# EAGLE design PCB_CanneASon (EAGLE 9.6.2)
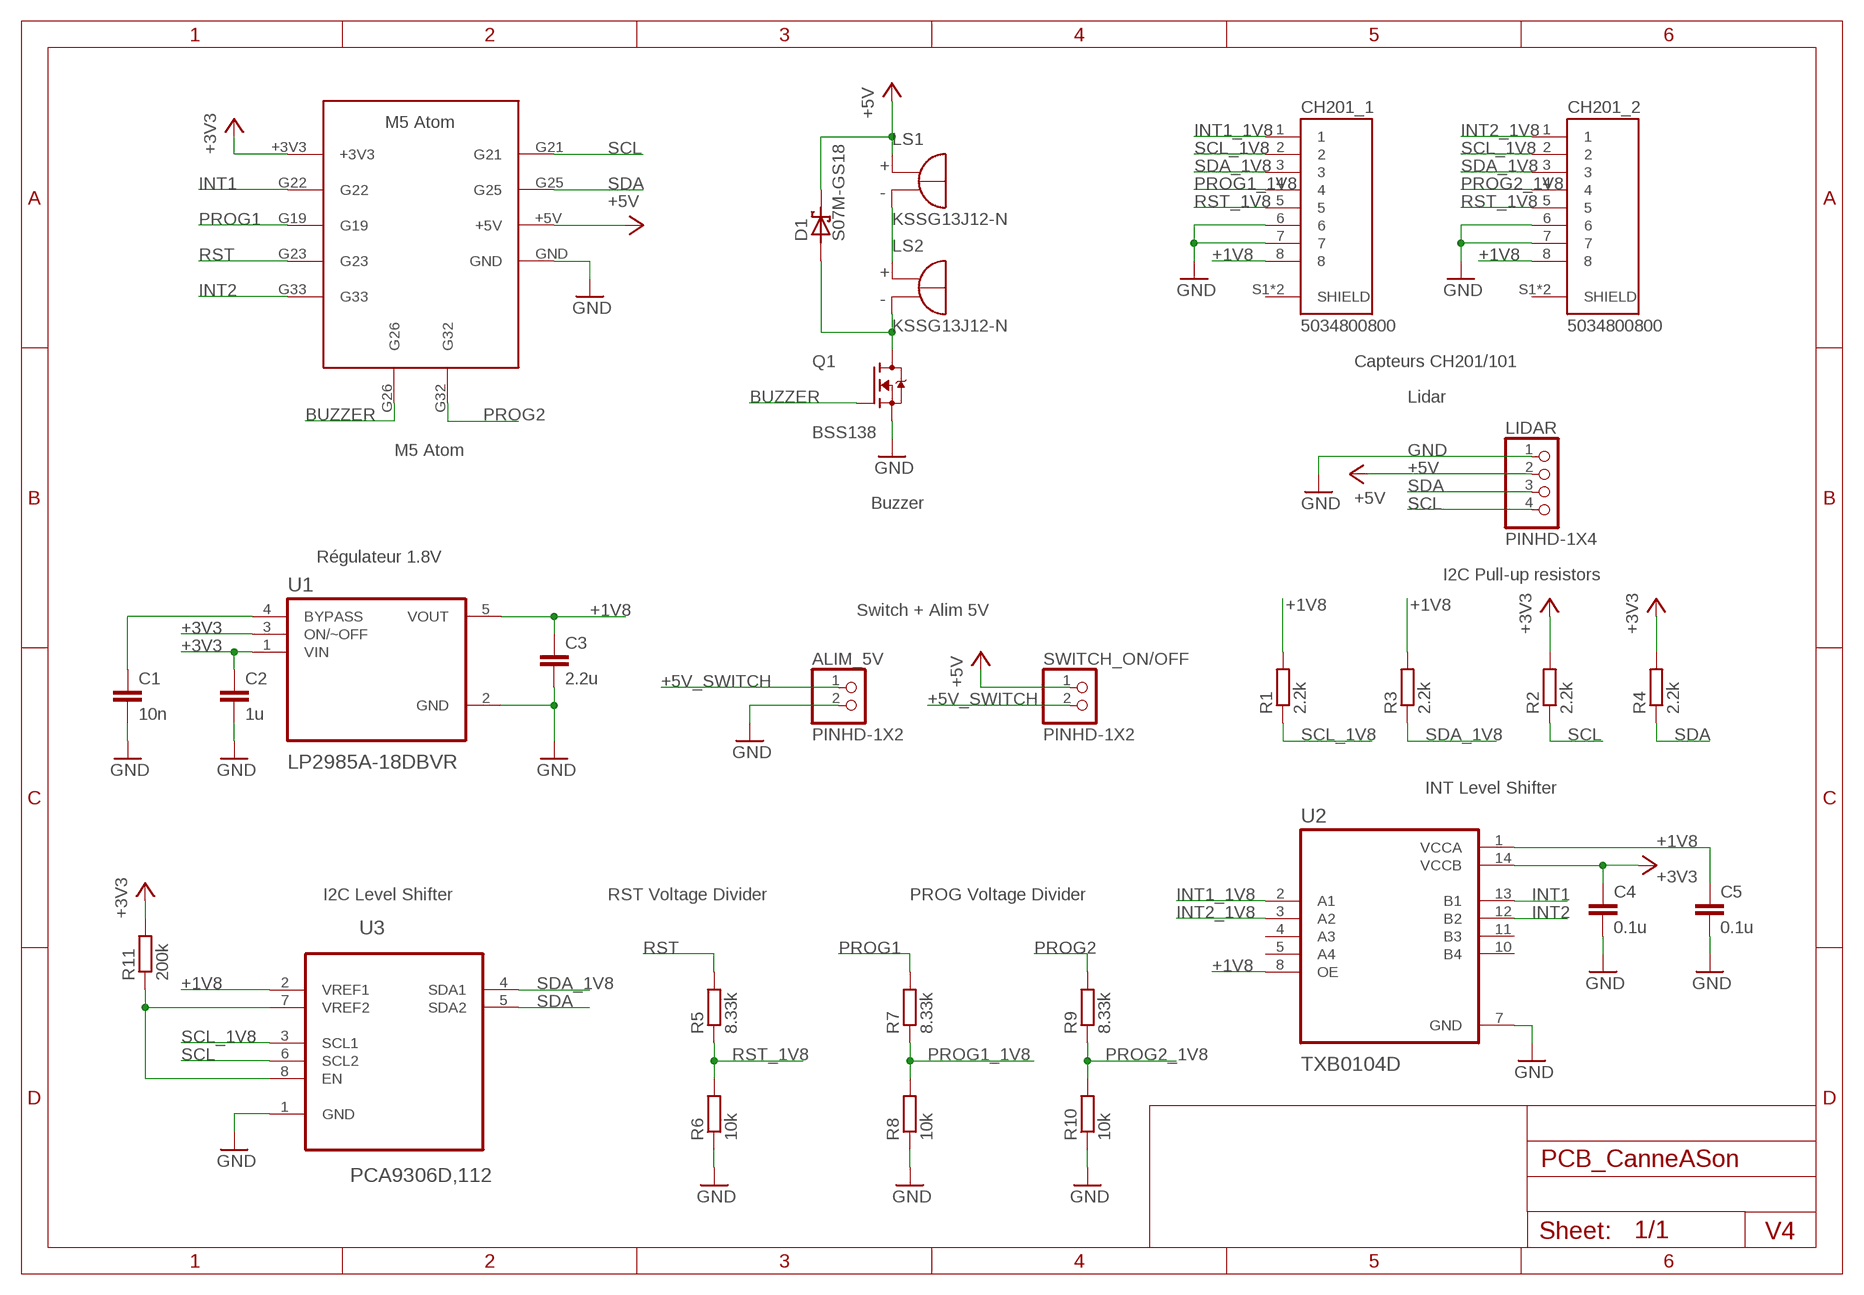
[diagram p0: schematic, sheet 1]

## Parts
ALIM_5V  PINHD-1X2  [1X02]
C1  10n  C-EUC0805  [C0805]
C2  1u  C-EUC0805  [C0805]
C3  2.2u  C-EUC0805  [C0805]
C4  0.1u  C-EUC0805  [C0805]
C5  0.1u  C-EUC0805  [C0805]
CH201_1  5034800800  [MOLEX_5034800800]
CH201_2  5034800800  [MOLEX_5034800800]
D1  S07M-GS18  [DO-219AB]
LIDAR  PINHD-1X4  [1X04]
LS1  KSSG13J12-N  [XDCR_KSSG13J12-N]
LS2  KSSG13J12-N  [XDCR_KSSG13J12-N]
Q1  BSS138  [SOT95P240X111-3N]
R1  2.2k  R-EU_R0805  [R0805]
R2  2.2k  R-EU_R0805  [R0805]
R3  2.2k  R-EU_R0805  [R0805]
R4  2.2k  R-EU_R0805  [R0805]
R5  8.33k  R-EU_R0805  [R0805]
R6  10k  R-EU_R0805  [R0805]
R7  8.33k  R-EU_R0805  [R0805]
R8  10k  R-EU_R0805  [R0805]
R9  8.33k  R-EU_R0805  [R0805]
R10  10k  R-EU_R0805  [R0805]
R11  200k  R-EU_R0805  [R0805]
SWITCH_ON/OFF  PINHD-1X2  [1X02]
U1  LP2985A-18DBVR  [SOT95P280X145-5N]
U2  TXB0104D  [SOIC127P600X175-14N]
U3  PCA9306D,112  [SOIC127P600X175-8N]
U$1  M5ATOM  [M5ATOM]

## Nets
+1V8: C3.1 C5.1 CH201_1.8 CH201_2.8 R1.2 R3.2 U1.5(VOUT) U2.1(VCCA) U2.8(OE) U3.2(VREF1)
+3V3: C2.1 C4.1 R2.2 R4.2 R11.2 U1.1(VIN) U1.3(ON/~OFF) U2.14(VCCB) U$1.+3V3
+5V: D1.C LIDAR.2 LS1.P(POS) SWITCH_ON/OFF.1 U$1.+5V
+5V_SWITCH: ALIM_5V.1 SWITCH_ON/OFF.2
BUZZER: Q1.1(G) U$1.G26
GND: ALIM_5V.2 C1.2 C2.2 C3.2 C4.2 C5.2 CH201_1.6 CH201_1.7 CH201_2.6 CH201_2.7 LIDAR.1 Q1.2(S) R6.1 R8.1 R10.1 U1.2(GND) U2.7(GND) U3.1(GND) U$1.GND
INT1: U2.13(B1) U$1.G22
INT1_1V8: CH201_1.1 U2.2(A1)
INT2: U2.12(B2) U$1.G33
INT2_1V8: CH201_2.1 U2.3(A2)
N$1: C1.1 U1.4(BYPASS)
N$2: LS1.N(NEG) LS2.P(POS)
N$3: D1.A LS2.N(NEG) Q1.3(D)
N$5: R11.1 U3.7(VREF2) U3.8(EN)
PROG1: R7.2 U$1.G19
PROG1_1V8: CH201_1.4 R7.1 R8.2
PROG2: R9.2 U$1.G32
PROG2_1V8: CH201_2.4 R9.1 R10.2
RST: R5.2 U$1.G23
RST_1V8: CH201_1.5 CH201_2.5 R5.1 R6.2
SCL: LIDAR.4 R2.1 U3.6(SCL2) U$1.G21
SCL_1V8: CH201_1.2 CH201_2.2 R1.1 U3.3(SCL1)
SDA: LIDAR.3 R4.1 U3.5(SDA2) U$1.G25
SDA_1V8: CH201_1.3 CH201_2.3 R3.1 U3.4(SDA1)
Unconnected: CH201_1.S1(SHIELD) CH201_1.S2(SHIELD) CH201_2.S1(SHIELD) CH201_2.S2(SHIELD) U2.4(A3) U2.5(A4) U2.10(B4) U2.11(B3)

## Notes on the sheet
- Capteurs CH201/101
- Lidar
- M5 Atom
- Buzzer
- Régulateur 1.8V
- I2C Pull-up resistors
- Switch + Alim 5V
- INT Level Shifter
- I2C Level Shifter | RST Voltage Divider | PROG Voltage Divider
- V4

## Library data of the parts
ALIM_5V SWITCH_ON/OFF = Connector:PINHD-1X2: PIN HEADER; CATEGORY: CONNECTOR; SUB-CATEGORY: PIN-HEADER
C1-C5 = rcl:C-EU: CAPACITOR, European symbol; SPICEPREFIX: C
CH201_1 CH201_2 = 5034800800:5034800800: 8 Position FFC, FPC Connector Contacts, Top and Bottom 0.020" (0.50mm) Surface Mount, Right Angle Check availability <https://pricing.snapeda.com/parts/5034800800/Molex/view-part?ref=eda>; AVAILABILITY: In Stock; DESCRIPTION: 8 Position FFC, FPC Connector Contacts, Top and Bottom 0.020 (0.50mm) Surface Mount, Right Angle; MF: Molex; MP: 5034800800; PACKAGE: None; PRICE: None; PURCHASE-URL: https://pricing.snapeda.com/search/part/5034800800/?ref=eda
D1 = S07M-GS18:S07M-GS18; AVAILABILITY: In Stock; DESCRIPTION: Diode Schottky 150 V 1A Surface Mount DO-219AB (SMF); MF: Vishay; MP: V1FM15HM3/I; PACKAGE: DO-219AB Vishay; PRICE: None; PURCHASE-URL: https://pricing.snapeda.com/search/part/V1FM15HM3/I/?ref=eda
LIDAR = Connector:PINHD-1X4: PIN HEADER; CATEGORY: CONNECTOR; SUB-CATEGORY: PIN-HEADER
LS1 LS2 = KSSG13J12-N:KSSG13J12-N: Check availability <https://pricing.snapeda.com/parts/KSSG13J12-N/Kingstate/view-part?ref=eda>; AVAILABILITY: In Stock; DESCRIPTION: 5mm, 2~4V,2.73KHz, 78dB, Magnetic Buzzer, SMT; MF: Kingstate; MP: KSSG13J12-N; PACKAGE: PLCC-28 Kingstate; PRICE: None
Q1 = BSS138:BSS138: N-Channel 50V 220mA (Ta) 360mW (Ta) Surface Mount SOT-23-3 Check availability <https://pricing.snapeda.com/parts/BSS138/ON%20Semiconductor/view-part?ref=eda>; AVAILABILITY: In Stock; DESCRIPTION: N-Channel 50 V 200mA (Ta) 225mW (Ta) Surface Mount SOT-23-3 (TO-236); MF: ON Semiconductor; MP: BSS138; PACKAGE: SOT-23 ON; PRICE: None; PURCHASE-URL: https://pricing.snapeda.com/search/part/BSS138/?ref=eda
R1-R11 = rcl:R-EU_: RESISTOR, European symbol; SPICEPREFIX: R
U1 = LP2985A-18DBVR:LP2985A-18DBVR; DESCRIPTION: 150-mA, 16-V, low-dropout voltage regulator with high-accuracy; DIGI-KEY_PART_NUMBER: 296-18477-2-ND; MF: Texas Instruments; MP: LP2985A-18DBVR; PACKAGE: SOT-23-5 Texas Instruments; PURCHASE-URL: https://pricing.snapeda.com/search/part/LP2985A-18DBVR/?ref=eda
U2 = TXB0104D:TXB0104D: Check availability <https://pricing.snapeda.com/parts/TXB0104D/Texas%20Instruments/view-part?ref=eda>; AVAILABILITY: In Stock; DESCRIPTION: 4-Bit Bidirectional Voltage-Level Shifter with Auto Direction Sensing and +/-15 kV ESD Protect; MF: Texas Instruments; MP: TXB0104D; PACKAGE: SOIC-14 Texas Instruments; PRICE: None; PURCHASE-URL: https://pricing.snapeda.com/search/part/TXB0104D/?ref=eda
U3 = PCA9306D_112:PCA9306D,112: Dual bidirectional I2C-bus and SMBus voltage-level translator Check availability <https://pricing.snapeda.com/parts/PCA9306D%2C112/NXP%20USA/view-part?ref=eda>; AVAILABILITY: In Stock; DESCRIPTION: Voltage Level Translator Bidirectional 1 Circuit 2 Channel - 8-SO; MF: NXP USA; MP: PCA9306D,112; PACKAGE: SO-8 NXP Semiconductors; PRICE: None; PURCHASE-URL: https://pricing.snapeda.com/search/part/PCA9306D,112/?ref=eda
U$1 = M5Atom:M5ATOM

## Board
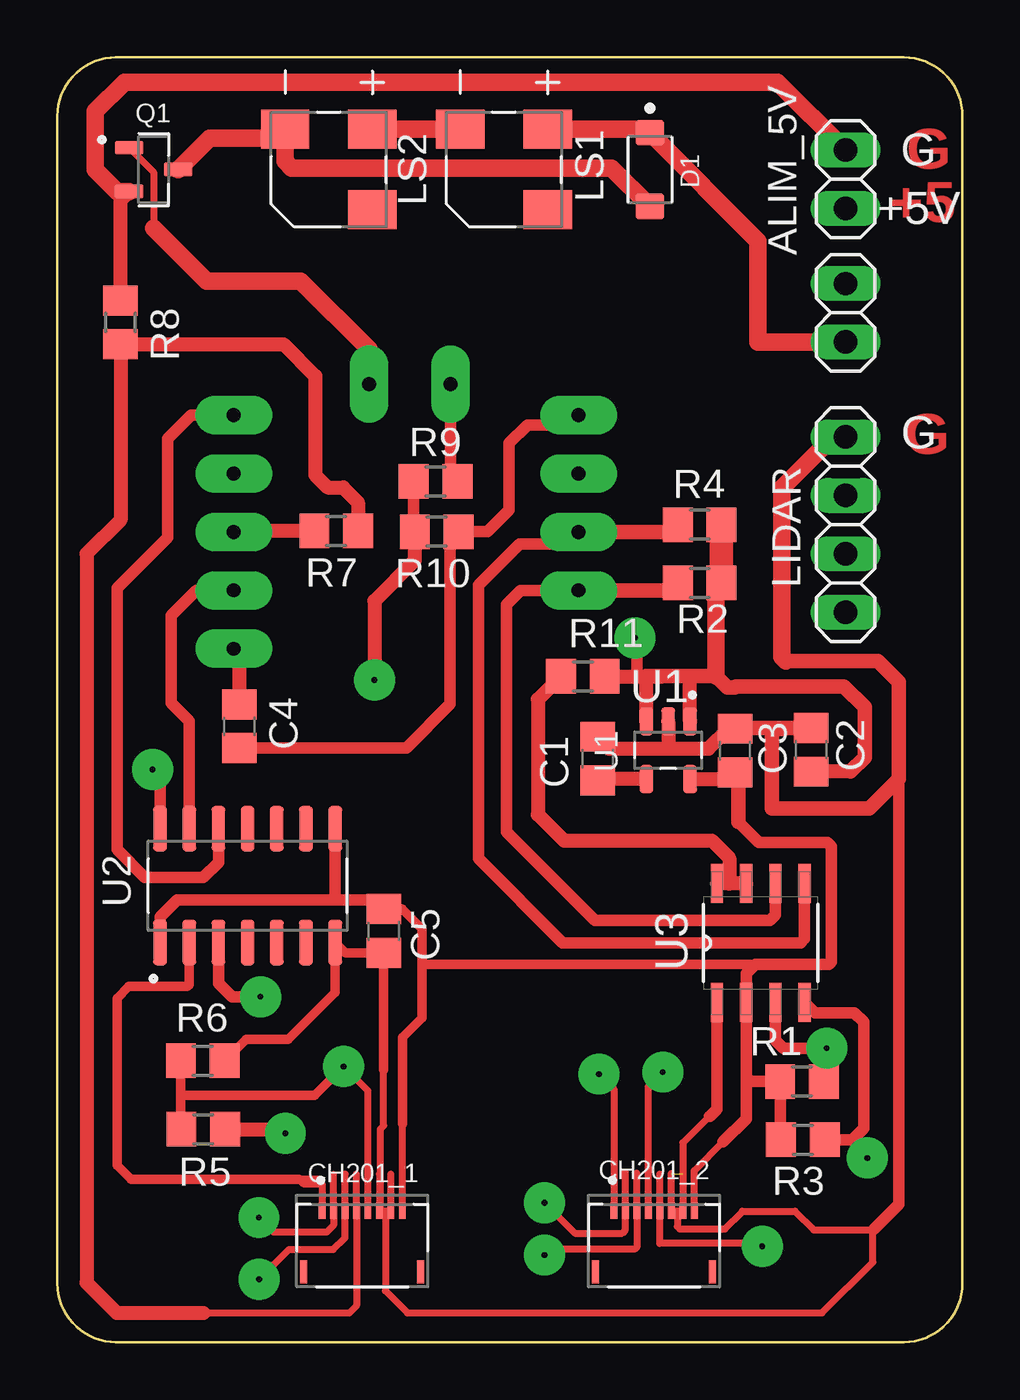
[diagram p1: board, top side]
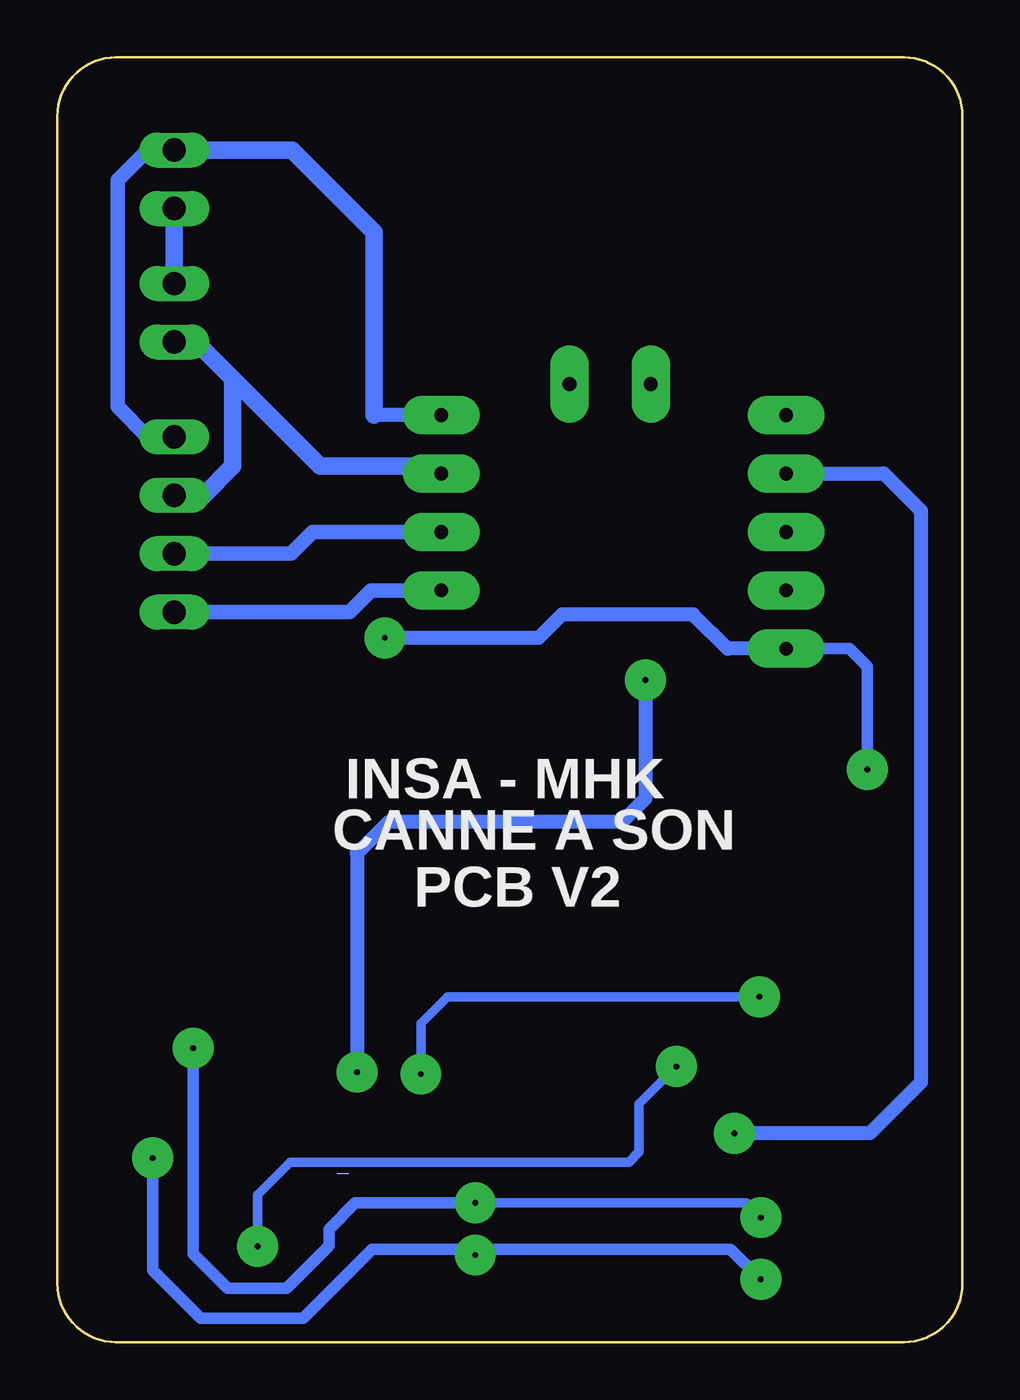
[diagram p2: board, bottom side, seen from below]

Size 39.37 x 55.88 mm. Coordinates in mm from the lower left corner, seen from the top.
Outline: 2.54,0 36.83,0 arc90 39.37,2.54 39.37,53.34 arc90 36.83,55.88 2.54,55.88 arc90 0,53.34 0,2.54 arc90 2.54,0
Copper layers (1*16): Top 0.035mm / dielectric 1.5mm / Bottom 0.035mm
Design rules "default *": minimum track width 12mil, minimum drill 0.1mm, track to track 6mil, track to pad 6mil, pad to pad 6mil, via to via 6mil, smd to smd 6mil, copper to edge 12mil, drill to drill 6mil, minimum pad ring 10mil, minimum via ring 8mil, stop-mask expansion 4mil, vias tented up to drill 0mil, thermal gap 10mil

### Footprints (pad centres in the part's own frame; a part is rotated, then mirrored left to right if it is on the bottom)
1X02 = drill 1.016 long: 1 -1.27,0; 2 1.27,0
C0805 = smd 1.3 x 1.5: 1 -0.95,0; 2 0.95,0
MOLEX_5034800800 = smd 0.3 x 0.7: 1 -1.75,0; 2 -1.25,0; 3 -0.75,0; 4 -0.25,0; 5 0.25,0; 6 0.75,0; 7 1.25,0; 8 1.75,0 | smd 0.3 x 1: S1 -2.54,-2.65; S2 2.54,-2.65
DO-219AB = smd 1.11 x 1.22: A 1.6,0; C -1.6,0
1X04 = drill 1.016 long: 1 -3.81,0; 2 -1.27,0; 3 1.27,0; 4 3.81,0
XDCR_KSSG13J12-N = smd 1.7 x 2.1: N -1.75,-1.9; NC 1.75,1.9; P -1.75,1.9
SOT95P240X111-3N = smd 1.23 x 0.6: 1 -1.06,0.95; 2 -1.06,-0.95; 3 1.06,0
R0805 = smd 1.3 x 1.5: 1 -0.95,0; 2 0.95,0
SOT95P280X145-5N = smd 1.21 x 0.59: 1 -1.255,0.95; 2 -1.255,0; 3 -1.255,-0.95; 4 1.255,-0.95; 5 1.255,0.95
SOIC127P600X175-14N = smd 1.97 x 0.6: 1 -2.475,3.81; 2 -2.475,2.54; 3 -2.475,1.27; 4 -2.475,0; 5 -2.475,-1.27; 6 -2.475,-2.54; 7 -2.475,-3.81; 8 2.475,-3.81; 9 2.475,-2.54; 10 2.475,-1.27; 11 2.475,0; 12 2.475,1.27; 13 2.475,2.54; 14 2.475,3.81
SOIC127P600X175-8N = smd 1.702 x 0.533: 1 -2.591,1.905; 2 -2.591,0.635; 3 -2.591,-0.635; 4 -2.591,-1.905; 5 2.591,-1.905; 6 2.591,-0.635; 7 2.591,0.635; 8 2.591,1.905
M5ATOM = drill 0.6 pad 1.676 long: +3V3 17.73,14.29; +5V 2.73,6.67; G19 17.73,9.21; G21 2.73,11.75; G22 17.73,11.75; G23 17.73,6.67; G25 2.73,9.21; G26 11.84,2.78; G32 8.3,2.78; G33 17.73,4.13; GND 2.73,4.13

### Placement (x,y rotation side)
ALIM_5V  34.29,50.58 90 top
C1  23.5,25.38 90 top
C2  32.79,25.76 90 top
C3  29.47,25.73 90 top
C4  7.91,26.79 270 top
C5  14.2,17.88 270 top
CH201_1  13.25,5.7 0 top
CH201_2  25.95,5.7 0 top
D1  25.77,51 270 top
LIDAR  34.29,35.56 270 top
LS1  19.42,51 270 top
LS2  11.8,51 270 top
Q1  4.18,51 0 top
R1  32.39,11.34 180 top
R2  27.94,33.02 0 top
R3  32.43,8.8 180 top
R4  27.94,35.56 0 top
R5  6.34,9.26 0 top
R6  6.32,12.23 180 top
R7  12.13,35.28 180 top
R8  2.74,44.36 270 top
R9  16.45,37.44 0 top
R10  16.49,35.25 180 top
R11  22.86,28.96 0 top
SWITCH_ON/OFF  34.29,44.77 90 top
U1  26.57,25.74 270 top
U2  8.27,19.85 90 top
U3  30.6,17.36 90 top
U$1  25.4,44.45 180 top

### Tracks (layer width: path | path; a pad name or v marks a point on that pad's centre or on a via)
+1V8
  Top 0.305: CH201_2.8 27.7,7.45 28.96,8.71 | 15.04,9.52 15.01,9.48 CH201_1.8
  Top 0.406: C5.1 15,18.83 15.87,17.97 15.87,16.42 | 15.87,16.42 15.87,14.11 15.01,13.25 15.01,9.48 | 31.07,16.43 15.87,16.43 15.87,16.42
  Top 0.508: 29.63,22.62 30.52,21.73 33.5,21.73 33.68,21.55 33.68,16.55 33.56,16.43 31.07,16.43 30.36,16.43 29.96,16.03 U3.2 29.96,11.52 | 29.96,11.52 29.96,9.71 28.96,8.71 | 31.53,8.86 R3.2 31.44,8.84 R1.2 30.14,11.34 29.96,11.52 | 12.08,19.23 U2.8 | U2.1 4.46,18.49 5.2,19.23 12.08,19.23 | 12.08,19.23 13.8,19.23 C5.1
  Top 0.61: U1.5 29.49,24.49 29.63,24.62
  Top 0.635: C3.1 29.63,24.62 29.63,22.62
+3V3  (via drill 0.25 pad 1.78)
  Top 0.381: R2.2 28.64,32.77
  Top 0.508: v25.13,30.63 25.2,30.56 25.2,28.96 | v4.13,24.91 4.13,24.54 4.46,24.21 U2.14
  Top 0.61: 34.5,24.81 C2.1 | U1.1 27.52,28.98 | U1.3 25.62,28.98 | R11.2 25.2,28.96 26.33,28.96 26.36,28.98 | U$1.+3V3 7.91,29.92 C4.1
  Top 0.635: 25.62,28.98 26.36,28.98 27.52,28.98 28.64,28.98 29.15,28.47 29.48,28.47 29.52,28.52 34.22,28.52 35.12,27.62 35.12,25.43 34.5,24.81
  Top 0.762: 28.64,32.77 28.64,28.98
  Top 1.016: R4.2 R2.2
  Bottom 0.508: U$1.+3V3 4.91,30.16 4.13,29.38 v4.13,24.91 | v4.13,24.91
  Bottom 0.61: U$1.+3V3 10.2,30.16 10.21,30.15 11.72,31.65 17.42,31.65 18.44,30.63 v25.13,30.63
+5V
  Top 0.762: LS1.P 25.62,52.75 D1.C 30.48,47.9 30.48,43.5 SWITCH_ON/OFF.1
  Bottom 0.635: U$1.+5V 22.99,38.1
  Bottom 0.762: 31.75,41.91 27.94,38.1 22.99,38.1 | 31.75,41.91 33.34,43.5 SWITCH_ON/OFF.1 | LIDAR.2 33.02,36.83 31.75,38.1 31.75,41.91
+5V_SWITCH
  Bottom 0.762: ALIM_5V.1 SWITCH_ON/OFF.2
BUZZER
  Top 0.305: Q1.1 4.18,50.89 4.18,48.46
  Top 0.762: 4.18,48.46 6.49,46.16 10.59,46.16 13.56,43.19 U$1.G26
GND  (1 unrouted)
  Top 0.305: CH201_1.6 CH201_1.7 14.51,7.29 14.5,7.3 | CH201_1.6 14.27,5.44 14.27,2.22 15.22,1.26 33.27,1.26 35.48,3.48 35.48,4.88 | CH201_1.6 | 14.01,7.3 CH201_1.6 | 26.71,7.32 26.7,7.31 CH201_2.6 CH201_2.7 | 27.21,7.31 27.2,7.31 | 28.36,9.82 27.2,8.67 CH201_2.7 | 27.08,4.91 27.07,4.92 | 27.07,4.92 26.96,5.03 26.96,5.46 CH201_2.7 | 27.07,4.92 29.05,4.92 29.8,5.67 29.8,5.7 32.09,5.7 32.9,4.88 35.48,4.88 | 35.48,4.88 35.56,4.96 | CH201_1.6 14.04,5.73 14.04,9.25 14.2,9.41 14.2,12.1
  Top 0.406: U2.7 12.53,16.93 C5.2 14.2,12.1 14.2,11.85 14.19,11.84 | R6.1 8.2,13.16 10.04,13.16 12.08,15.2 12.08,16.82
  Top 0.508: U3.1 28.69,10.13 28.39,9.82 28.36,9.82 | 36.6,24.49 36.6,5.99 35.56,4.96 35.51,4.91 | 12.08,16.82 U2.7 | 22.6,40.25 U$1.GND 22.25,39.9 20.44,39.9 19.64,39.1 19.64,36.19 18.7,35.25 R10.1 | R10.1 | C4.2 15.18,25.84 17.09,27.75 17.09,34.89 R10.1
  Top 0.61: 24,25.82 26.54,25.82 | C3.2 29.19,26.68 28.32,25.82 26.54,25.82 | U1.2 26.57,25.85 26.54,25.82 | R8.1 2.74,49.67 Q1.2
  Top 0.635: C2.2 31.52,26.71 | 31.52,26.71 31.52,26.68 31.08,26.68 31.08,23.22 35.33,23.22 36.6,24.49 36.6,28.72 35.69,29.63 31.69,29.63 | C1.2 24,25.82 | C3.2 29.5,26.71 31.52,26.71
  Top 0.762: Q1.2 2.59,50.05 1.64,51 1.64,53.54 2.91,54.81 31.33,54.81 ALIM_5V.2 | 31.69,29.63 31.52,29.8 31.52,37.15 33.74,39.37 LIDAR.1
  Bottom 0.61: U$1.GND 25.6,40.32
  Bottom 0.635: ALIM_5V.2 35.44,51.85 36.76,50.54 36.76,40.69 35.44,39.37 LIDAR.1
  Bottom 0.762: 25.6,40.32 25.6,48.28 29.16,51.85 ALIM_5V.2 34.41,51.73
INT1
  Top 0.508: U$1.G22 6.04,32.7 4.94,31.6 4.94,27.81 5.73,27.01 U2.13
INT1_1V8
  Top 0.305: CH201_1.1 11.51,6.88 10.7,6.88 10.51,7.07 11.48,7.07 11.51,7.04 | 11.51,7.04
  Top 0.406: 10.51,7.07 3.2,7.07 2.59,7.68 2.59,14.95 3.1,15.46 5.65,15.46 5.73,15.55 U2.2
INT2
  Top 0.508: U2.12 7,20.87 6.34,20.21 3.8,20.21 2.59,21.42 2.59,32.79 4.79,34.99 4.79,39.3 5.81,40.32 U$1.G33
INT2_1V8  (via drill 0.25 pad 1.78)
  Top 0.305: v23.56,11.66 24.2,11.01 CH201_2.1
  Top 0.508: U2.3 7,15.61 7.59,15.02 v8.83,15.02
  Bottom 0.406: v8.83,15.02 22.39,15.02 23.56,13.85 v23.56,11.66
N$1
  Top 0.61: U1.4 23.56,24.49 C1.1
N$2
  Top 0.762: LS2.P LS1.N
N$3
  Top 0.762: LS2.N 9.9,52.37 | 9.9,52.37 9.9,51.36 10.2,51.07 24.11,51.07 D1.A | Q1.3 6.61,52.37 9.9,52.37
N$5
  Top 0.61: U3.7 29.23,19.95 | 29.23,19.95 U3.8 | R11.1 20.91,27.95 20.91,22.95 22.04,21.82 28.46,21.82 29.23,21.05 29.23,19.95
PROG1
  Top 0.508: 11.13,35.24 R7.2
  Top 0.61: R7.2 7.71,35.28 U$1.G19
PROG1_1V8
  Top 0.305: 13.01,7.31 CH201_1.4 13.01,1.57 12.7,1.27 6.35,1.27
  Top 0.61: R7.1 13.08,36.53 12.43,37.17 11.75,37.17 11.22,37.71 11.22,42.02 9.83,43.41 R8.2 2.74,35.76 1.27,34.29 1.27,2.59 2.59,1.27 6.35,1.27
PROG2
  Top 0.508: U$1.G32 17.1,37.73 R9.2
PROG2_1V8  (via drill 0.25 pad 1.78)
  Top 0.305: v26.34,11.74 25.7,11.11 CH201_2.4
  Top 0.508: R9.1 15.5,35.3 R10.2
  Top 0.61: R10.2 15.54,34 13.79,32.24 v13.79,28.8
  Bottom 0.61: v13.79,28.8 13.79,23.64 14.81,22.62 24.97,22.62 26.34,21.25 v26.34,11.74
RST  (via drill 0.25 pad 1.78)
  Top 0.61: R5.2 9.74,9.26 v9.91,9.08
  Bottom 0.61: U$1.G23 3.42,37.78 1.8,36.16 1.8,11.3 4.03,9.08 v9.91,9.08
RST_1V8  (via drill 0.25 pad 1.78)
  Top 0.305: 26.2,7.31 CH201_2.5 26.2,4.29 30.54,4.29 v30.66,4.16 | v12.45,11.99 13.51,10.93 CH201_1.5
  Top 0.406: R6.2 5.37,10.73 | 5.37,10.73 5.37,9.28 R5.1 | v12.45,11.99 11.19,10.73 5.37,10.73
  Bottom 0.406: v12.45,11.99 14.07,10.36 14.07,8.27 14.51,7.82 29.24,7.82 30.66,6.4 v30.66,4.16
SCL
  Top 0.508: U$1.G21 20.15,32.7 19.54,32.09 19.54,22.19 23.38,18.35 30.47,18.35 | 30.47,18.35 31,18.35 31.23,18.58 U3.6 | 30.47,18.35
  Top 0.635: R2.1 26.67,32.7 U$1.G21
  Bottom 0.381: 22.86,32.7 U$1.G21
  Bottom 0.635: LIDAR.4 26.67,31.75 25.72,32.7 U$1.G21 22.63,32.66
SCL_1V8  (via drill 0.25 pad 1.78)
  Top 0.305: 12,7.29 12.01,7.28 CH201_1.2 12,5.07 11.72,4.78 9.4,4.78 v8.77,5.41 | 24.7,7.38 CH201_2.2 24.7,4.87 24.57,4.74 22.5,4.74 v21.19,6.05
  Top 0.508: U3.3 31.23,13.13 31.58,12.78 v33.47,12.78 33.47,11.46 R1.1
  Bottom 0.406: v21.19,6.05 9.4,6.05 v8.77,5.41
  Bottom 0.508: v21.19,6.05 26.42,6.05 27.56,4.91 27.56,4.18 29.41,2.33 31.97,2.33 33.47,3.83 v33.47,12.78
SDA
  Top 0.508: U$1.G25 22.15,34.71 20.1,34.71 18.31,32.93 18.31,21.03 21.98,17.36 32.34,17.36 32.5,17.52 U3.5
  Top 0.635: R4.1 26.67,35.24 U$1.G25
  Bottom 0.635: LIDAR.3 29.21,34.29 28.26,35.24 U$1.G25
SDA_1V8  (via drill 0.25 pad 1.78)
  Top 0.305: 12.51,7.31 12.51,7.3 CH201_1.3 12.51,4.53 12,4.03 10.07,4.03 v8.78,2.73 | 25.21,7.36 25.2,7.36 CH201_2.3 25.2,4.12 25.12,4.04 22,4.04 21.75,3.79 v21.19,3.79
  Top 0.508: U3.4 32.95,14.32 34.68,14.32 35.08,13.92 35.08,9.29 34.58,8.8 R3.1 34.64,8.8 35.23,8.21 v35.23,8.01
  Bottom 0.508: v35.23,8.01 35.23,3.13 33.14,1.04 28.68,1.04 25.68,4.04 21.45,4.04 | 21.45,4.04 v21.19,3.79 | v8.78,2.73 10.09,4.04 21.45,4.04
  Bottom 0.635: v35.23,8.01 35.26,8.01

### Text on the board
Top: G | +5 | G
tNames: G | +5V | G | U1 | U3
bNames: INSA - MHK | CANNE A SON | PCB V2